# EAGLE design FabISP_Rev3 (EAGLE 6.4)
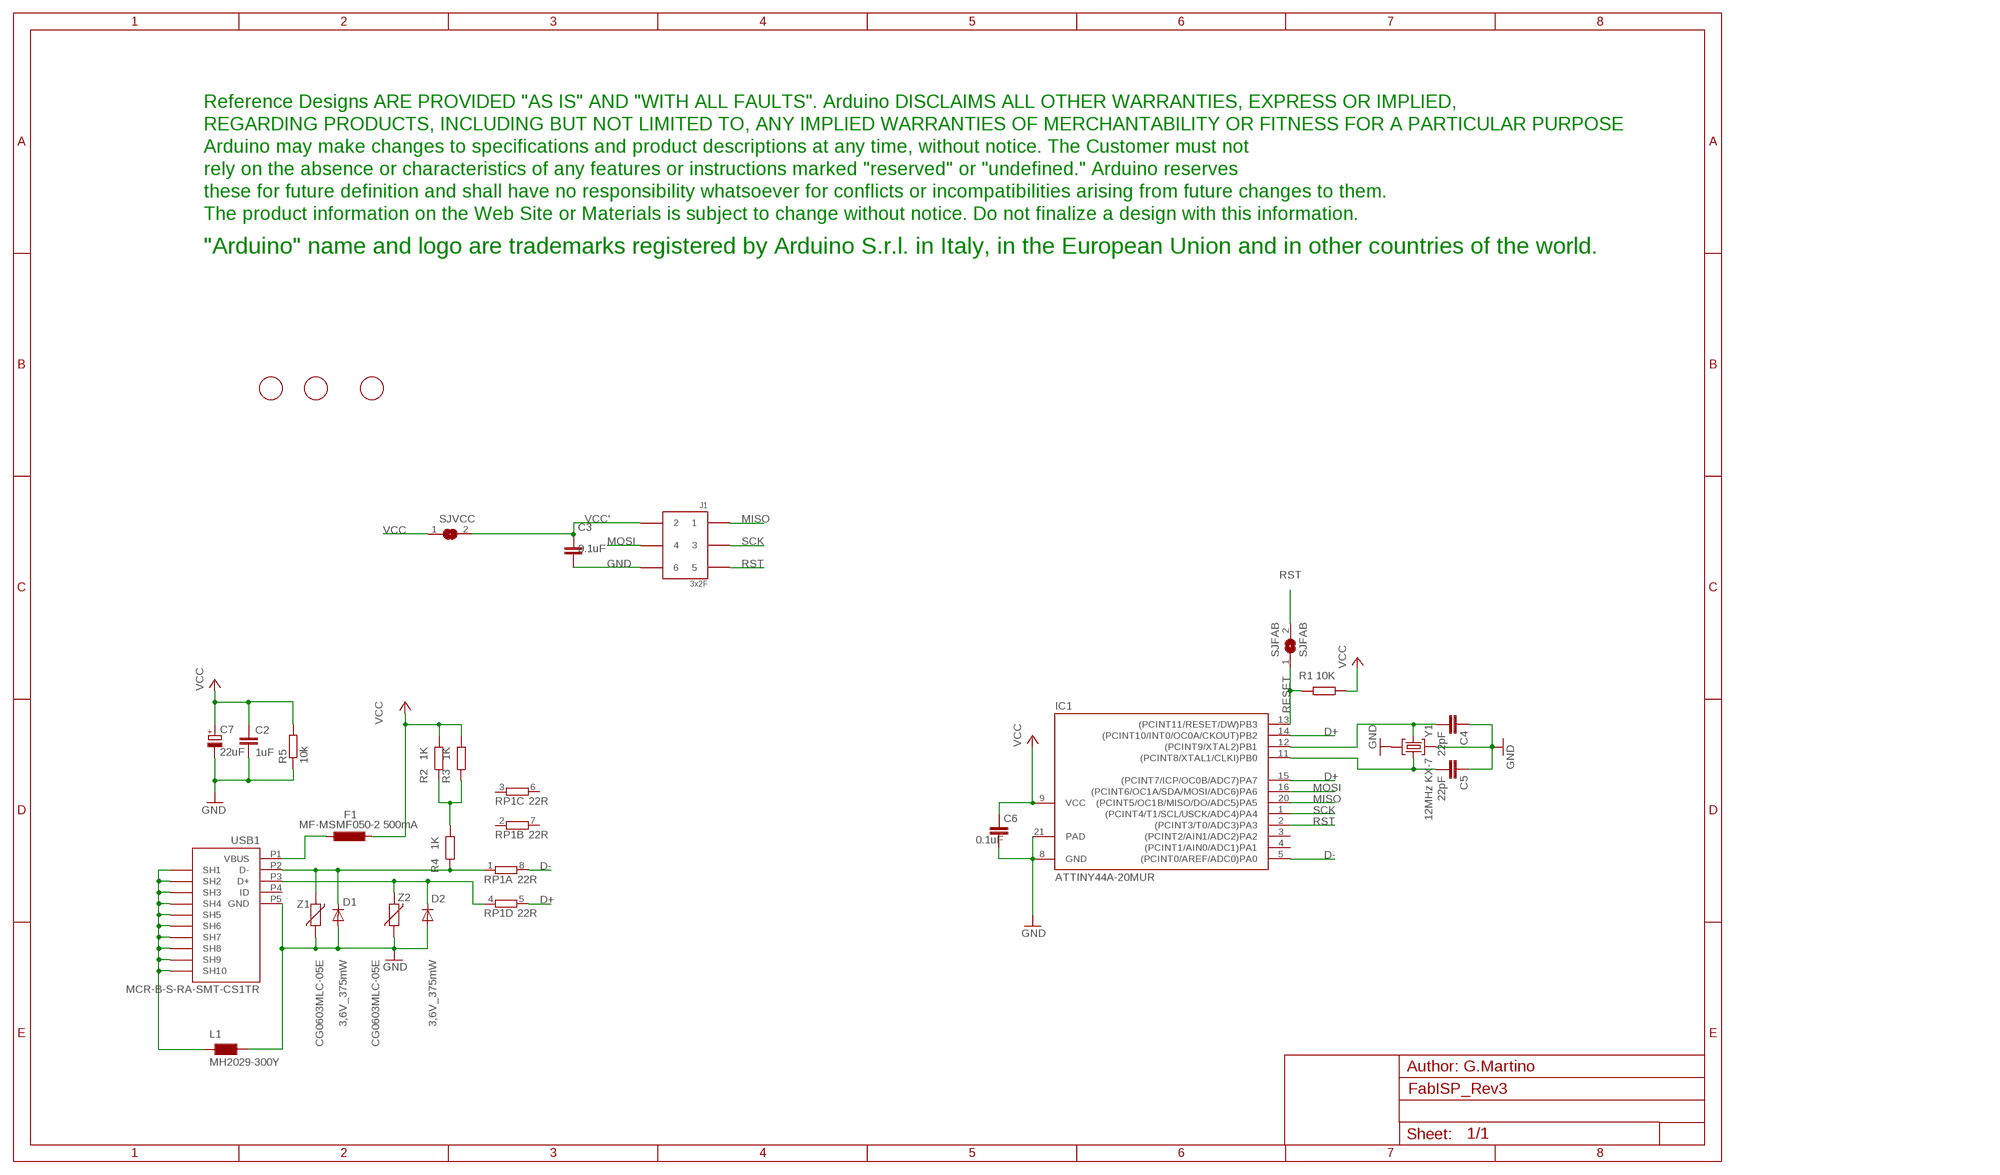
[diagram p0: schematic, sheet 1]

## Parts
C2  1uF  C-EUC0402  [C0402]
C3  0.1uF  C-EUC0402  [C0402]
C4  22pF  C-EUC0402  [C0402]
C5  22pF  C-EUC0402  [C0402]
C6  0.1uF  C-EUC0402  [C0402]
C7  22uF  0167_  [SMC_B]
D1  3,6V_375mW  0730_BZT52H-B3V6  [SOD123]
D2  3,6V_375mW  0730_BZT52H-B3V6  [SOD123]
F1  MF-MSMF050-2 500mA  L-EUL1812  [L1812]
IC1  ATTINY44A-20MUR  ATTINY24_44_84_ATTINY24/44/84-MU  [ATTINY24_44_84_QFN/MLF20]
J1  3x2F  HEAD3X2  [HEAD3X2]
L1  MH2029-300Y  0001_BLM21PG300SN1D_/_MH2029-300Y  [0805]
R1  10K  R-EU_R0402  [R0402]
R2  1K  R-EU_R0402  [R0402]
R3  1K  R-EU_R0402  [R0402]
R4  1K  R-EU_R0402  [R0402]
R5  10k  0028_CR0603JW103L  [R0603-ROUND]
RP1  22R  4R-NCAY16  [CAY16]
SJFAB  SJFAB  [SJFAB]
SJVCC  SJFAB  [SJFAB]
U$1  FIDUCIALMOUNT  [FIDUCIA-MOUNT]
U$2  FIDUCIALMOUNT  [FIDUCIA-MOUNT]
U$3  FIDUCIALMOUNT  [FIDUCIA-MOUNT]
U$5  DISCLAIMER  [DISCLAIMER]
USB1  MCR-B-S-RA-SMT-CS1TR  0158_MCR-B-S-RA-SMT-CS1TR  [CON2_USB_MICRO_B_AT]
Y1  12MHz KX-7  CRYSTAL-3.2-2.5  [CRYSTAL-3.2-2.5]
Z1  CG0603MLC-05E  VARISTORCN0603  [CT/CN0603]
Z2  CG0603MLC-05E  VARISTORCN0603  [CT/CN0603]

## Nets
D+: IC1.14((PCINT10/INT0/OC0A/CKOUT)PB2) IC1.15((PCINT7/ICP/OC0B/ADC7)PA7) RP1.5
D-: IC1.5((PCINT0/AREF/ADC0)PA0) RP1.8
GND: C2.2 C3.2 C4.1 C5.1 C6.2 C7.- D1.A D2.A IC1.8(GND) IC1.21(PAD) J1.6 L1.2 R5.1 USB1.P5(GND) Y1.2(GND) Y1.4(GND) Z1.1 Z2.1
MISO: IC1.20((PCINT5/OC1B/MISO/DO/ADC5)PA5) J1.1
MOSI: IC1.16((PCINT6/OC1A/SDA/MOSI/ADC6)PA6) J1.4
N$1: D1.C R4.1 RP1.1 USB1.P2(D-) Z1.2
N$2: D2.C RP1.4 USB1.P3(D+) Z2.2
N$3: R2.1 R3.1 R4.2
N$5: L1.1 USB1.P$1(SH7) USB1.P$2(SH8) USB1.P$3(SH9) USB1.P$4(SH10) USB1.P$5(SH7) USB1.P$6(SH8) USB1.P$7(SH9) USB1.P$8(SH10) USB1.S1(SH1) USB1.S2(SH2) USB1.S3(SH3) USB1.S4(SH4) USB1.S5(SH5) USB1.S6(SH6)
N$8: F1.2 USB1.P1(VBUS)
RESET: IC1.13((PCINT11/RESET/DW)PB3) R1.1 SJFAB.1
RST: IC1.2((PCINT3/T0/ADC3)PA3) J1.5 SJFAB.2
SCK: IC1.1((PCINT4/T1/SCL/USCK/ADC4)PA4) J1.3
VCC: C2.1 C6.1 C7.+ F1.1 IC1.9(VCC) R1.2 R2.2 R3.2 R5.2 SJVCC.1
VCC': C3.1 J1.2 SJVCC.2
XTAL1: C4.2 IC1.12((PCINT9/XTAL2)PB1) Y1.3(C2)
XTAL2: C5.2 IC1.11((PCINT8/XTAL1/CLKI)PB0) Y1.1(C1)
Unconnected: IC1.3((PCINT2/AIN1/ADC2)PA2) IC1.4((PCINT1/AIN0/ADC1)PA1) RP1.2 RP1.3 RP1.6 RP1.7 USB1.P4(ID)

## Notes on the sheet
- Author: G.Martino

## Library data of the parts
C2-C6 = Smartprj:C-EU: CAPACITOR, European symbol
C7 = Condensatori:0167_: 22uF 25V; MONTHLY_USAGE: _____; PRICE: _____; SUPPLIER: _____; TYPE: Condensatori
D1 D2 = Diodi:0730_BZT52H-B3V6: Single Zener diode 3,6V 375mW SOD 123; CASE: SOD123; MONTHLY_USAGE: _____; PART_NUMBER: BZT52H-B3V6; PRICE: _____; SUPPLIER: _____; TYPE: Diodi
F1 = rcl:L-EU: INDUCTOR, European symbol
IC1 = Smartprj:ATTINY24_44_84_ATTINY24/44/84
J1 = MyCON2:HEAD3X2
L1 = Protezione:0001_BLM21PG300SN1D_/_MH2029-300Y: BLM21; MONTHLY_USAGE: _____; PART_NUMBER: BLM21PG300SN1D_/_MH2029-300Y; PRICE: _____; SUPPLIER: _____; TYPE: Protezione
R1-R4 = Smartprj:R-EU_: RESISTOR, European symbol
R5 = Resistenze:0028_CR0603JW103L: 10K 0603; CASE: 0603; MONTHLY_USAGE: _____; PART_NUMBER: CR0603JW103L; PRICE: _____; SUPPLIER: _____; TYPE: Resistenze
RP1 = resistor-dil:4R-N: Array Chip Resistor Source: RS Component / Phycomp
SJFAB SJVCC = mellis:SJFAB
U$1-U$3 = Smartprj:FIDUCIALMOUNT
U$5 = Misc:DISCLAIMER
USB1 = Connettori:0158_MCR-B-S-RA-SMT-CS1TR: Usb Micro F/90 Smd Tipo B; MONTHLY_USAGE: _____; PART_NUMBER: MCR-B-S-RA-SMT-CS1TR; PRICE: _____; SUPPLIER: _____; TYPE: Connettori
Y1 = Smartprj:CRYSTAL-3.2-2.5
Z1 Z2 = varistor:VARISTOR: VARISTOR

## Board
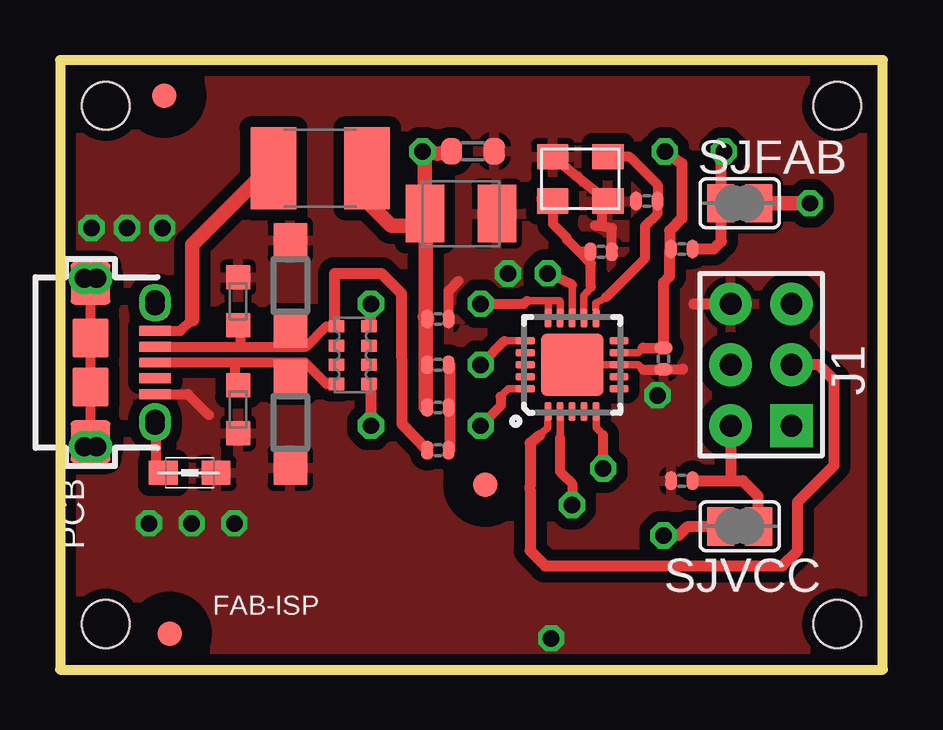
[diagram p1: board, top side]
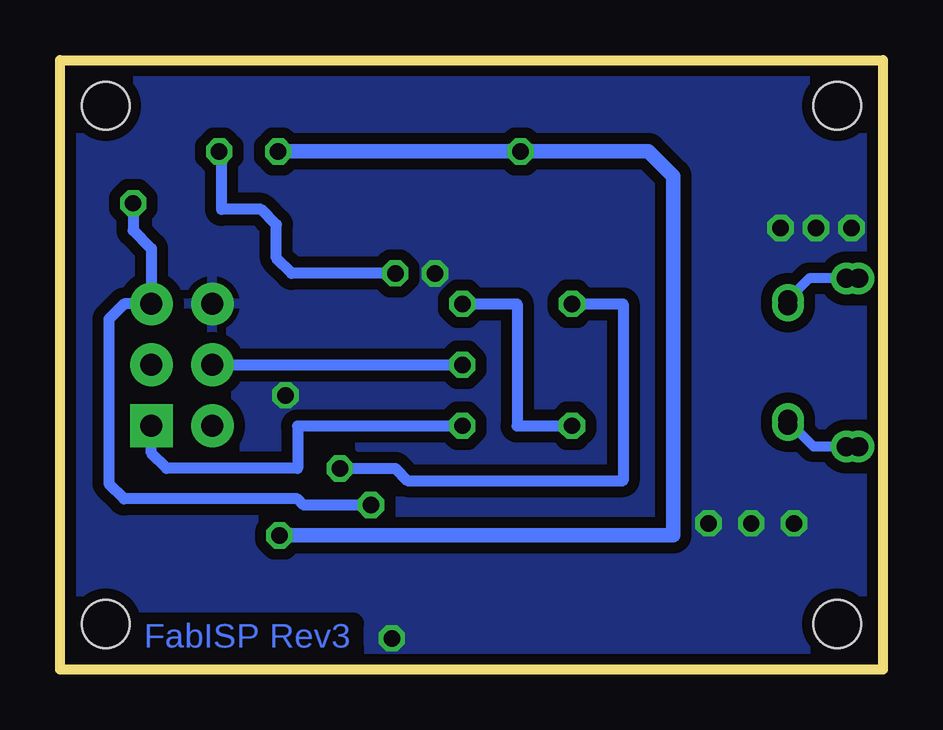
[diagram p2: board, bottom side, seen from below]

Size 34.29 x 25.4 mm. Coordinates in mm from the lower left corner, seen from the top.
Outline: 0,0 34.29,0 34.29,25.4 0,25.4 0,0
Copper layers (1*16): Top 0.035mm / dielectric 1.5mm / Bottom 0.035mm
Design rules "default *": minimum track width 11mil, minimum drill 27mil, track to track 7mil, track to pad 7mil, pad to pad 7mil, via to via 16mil, smd to smd 0mil, copper to edge 17mil, drill to drill 8mil, minimum pad ring 10mil, minimum via ring 8mil, stop-mask expansion 2mil, vias tented up to drill 27mil, thermal gap 10mil
Holes 2 mm at 32.38,23.5 1.91,23.5 1.91,1.91 32.38,1.91

### Footprints (pad centres in the part's own frame; a part is rotated, then mirrored left to right if it is on the bottom)
C0402 = smd 0.508 x 0.762: 1 -0.445,0; 2 0.445,0
SMC_B = smd 1.6 x 2.4: + -1.5,0; - 1.5,0
SOD123 = smd 1.4 x 1.4: A 1.9,0; C -1.9,0
L1812 = smd 1.9 x 3.4: 1 -1.95,0; 2 1.95,0
ATTINY24_44_84_QFN/MLF20 = smd 0.8 x 0.3: 1 -1.95,1; 2 -1.95,0.5; 3 -1.95,0; 4 -1.95,-0.5; 5 -1.95,-1; 11 1.95,-1; 12 1.95,-0.5; 13 1.95,0; 14 1.95,0.5; 15 1.95,1 | smd 0.3 x 0.8: 6 -1,-1.95; 7 -0.5,-1.95; 8 0,-1.95; 9 0.5,-1.95; 10 1,-1.95; 16 1,1.95; 17 0.5,1.95; 18 0,1.95; 19 -0.5,1.95; 20 -1,1.95 | smd 2.6 x 2.6: 21 0,0
HEAD3X2 = drill 0.914 pad 1.778 square: 1 0,0 | drill 0.914 pad 1.778: 2 0,2.54; 3 2.54,0; 4 2.54,2.54; 5 5.08,0; 6 5.08,2.54
0805 = smd 1.2 x 1: 1 -1.1,0; 2 1.1,0
R0402 = smd 0.508 x 0.762: 1 -0.445,0; 2 0.445,0
R0603-ROUND = smd 0.898 x 1.1: 1 -0.889,0; 2 0.889,0
CAY16 = smd 0.5 x 0.65: 1 -1.2,-0.675; 2 -0.4,-0.675; 3 0.4,-0.675; 4 1.2,-0.675; 5 1.2,0.675; 6 0.4,0.675; 7 -0.4,0.675; 8 -1.2,0.675
SJFAB = smd 1.118 x 1.6: 1 -0.787,0; 2 0.787,0
FIDUCIA-MOUNT = smd 1.016 x 1.016: P$1 0,0
CON2_USB_MICRO_B_AT = smd 0.406 x 1.346: P1 -1.321,2.692; P2 -0.66,2.692; P3 0,2.692; P4 0.66,2.692; P5 1.321,2.692 | drill 0.8 pad 1.24: P$1 -2.616,2.692; P$2 -2.362,2.692; P$7 2.362,2.692; P$8 2.616,2.692 | drill 0.8 pad 1.25: P$3 -3.505,-0.254; P$4 -3.505,0.254; P$5 3.505,0.254; P$6 3.505,-0.254 | smd 1.778 x 1.651: S1 -3.302,0; S2 3.302,0 | smd 1.524 x 1.27: S3 -2.489,2.692; S4 2.489,2.692 | smd 1.626 x 1.524: S5 -1.016,0; S6 1.016,0
CRYSTAL-3.2-2.5 = smd 1.3 x 1.05: 1 -1.15,-0.925; 2 1.15,-0.925; 3 1.15,0.925; 4 -1.15,0.925
CT/CN0603 = smd 1 x 1: 1 -1,0; 2 1,0

### Placement (x,y rotation side)
C2  15.75,14.61 0 top
C3  25.91,7.87 180 top
C4  22.55,17.41 180 top
C5  24.45,19.52 0 top
C6  25.15,12.95 270 top
C7  16.7,19 0 top
D1  9.6,16 90 top
D2  9.6,10.3 270 top
F1  10.85,20.89 180 top
IC1  21.34,12.7 90 top
J1  30.48,10.16 90 top
L1  5.4,8.2 0 top
R1  25.91,17.53 180 top
R2  15.75,12.7 180 top
R3  15.75,10.92 180 top
R4  15.75,9.14 0 top
R5  17.2,21.6 180 top
RP1  12.19,13.1 270 top
SJFAB  28.32,19.43 0 top
SJVCC  28.32,5.97 0 top
U$1  4.57,1.5 0 top
U$2  17.72,7.7 0 top
U$3  4.34,23.9 0 top
U$5  -5.2,-41 0 top  (outside the outline)
USB1  1.27,12.8 270 top
Y1  21.68,20.45 180 top
Z1  7.42,15.35 270 top
Z2  7.42,10.85 90 top

### Tracks (layer width: path | path; a pad name or v marks a point on that pad's centre or on a via)
D+  (via drill 0.69)
  Top 0.305: IC1.14 20.84,15.28 20.83,15.37 20.34,15.37 | 20.34,15.37 19.46,15.37 | IC1.15 20.34,15.28 20.34,15.37
  Top 0.406: v17.53,15.24 19.33,15.24 19.46,15.37 | RP1.5 12.95,11.5
  Top 0.457: 12.95,11.5 v12.95,10.16
  Bottom 0.457: v17.53,15.24 15.24,15.24 15.24,10.16 v12.95,10.16
D-  (via drill 0.69)
  Top 0.305: IC1.5 22.34,10.07 22.63,9.78
  Top 0.406: RP1.8 12.95,14.4 | v22.63,8.38 22.63,9.78
  Top 0.457: 12.95,14.4 v12.95,15.24
  Bottom 0.457: v12.95,15.24 10.82,15.24 10.82,7.87 19.81,7.87 20.32,8.38 v22.63,8.38
GND  (via drill 0.69)
  Top 0.305: IC1.21 IC1.8 24.1,12.7 24.3,12.5
  Top 0.406: Y1.2 arc3 Y1.4 22.6,19.49 22.6,18.5 22.3,18.5 23,18.4 22.99,18.39 C4.1 | 25.95,12.55 25.95,12.51 C6.2 25.14,12.5 24.3,12.5 | C2.2 16.19,15.79 16.6,16.2 | USB1.P5 5.33,11.47 6.2,10.6
  Top 0.457: 26.42,15.24 J1.6
  other vias: 24.89,11.43 4.27,18.4 7.27,6.1 2.79,18.4 5.49,6.1 1.31,18.4 3.71,6.1 20.47,1.3 18.67,16.5
  pour Top (isolate 0.457): 0,25.27 0,0 34.29,0 34.29,25.4 0,25.4
  pour Bottom (isolate 0.457): 0,25.4 34.29,25.4 34.29,0 0,0
MISO  (via drill 0.69)
  Top 0.305: IC1.20 18.68,11.7 18.36,11.38
  Top 0.406: 18.36,11.38 18.36,10.99 v17.53,10.16
  Bottom 0.457: J1.1 30.48,9.02 29.84,8.38 24.38,8.38 24.38,10.16 v17.53,10.16
MOSI  (via drill 0.69)
  Top 0.305: IC1.16 18.52,13.7
  Top 0.406: 18.52,13.7 v17.53,12.7
  Bottom 0.457: J1.4 v17.53,12.7
N$1
  Top 0.406: 11.43,14.37 RP1.1 | 11.59,14.29 RP1.1 | USB1.P2 7.5,13.46 | 7.5,13.46 9.6,13.46 | 9.6,13.46 10.26,13.46 11.1,14.3 RP1.1 | Z1.2 7.5,14.27 7.5,13.46 | D1.C 9.6,13.46
  Top 0.457: 11.43,14.37 11.43,16.51 13.39,16.51 14.22,15.68 14.25,10.24 15.29,9.17 R4.1
N$2
  Top 0.406: USB1.P3 7.3,12.8 | 7.3,12.8 9.7,12.8 | 9.7,12.8 10.2,12.8 11.1,11.9 RP1.4 | Z2.2 7.3,11.97 7.3,12.8 | D2.C 9.7,12.3 9.7,12.8
N$3
  Top 0.406: 16.26,10.79 R3.1 | 16.26,9.14 R4.2 | 16.26,12.7 R2.1
  Top 0.457: 16.26,9.14 16.26,10.79 | 16.26,12.7 16.26,10.92 R3.1
N$5
  Top 0.406: L1.1 4,8.5 4,10.14 USB1.P$8 USB1.S4 USB1.P$7 | USB1.S1 USB1.S5 USB1.S6 USB1.S2 | USB1.P$6 1.07,9.29 USB1.S2 | USB1.S2 1.32,9.49 USB1.P$5 1.69,9.29 1.9,9.5 1.8,9.5 1.7,9.4 | USB1.P$4 1.47,16.3 USB1.S1 | USB1.P$3 1.07,16.3 USB1.S1
  Top 0.61: USB1.P$1 USB1.S3 USB1.P$2
  Bottom 0.406: USB1.P$4 3.07,16.3 USB1.P$1 | USB1.P$7 3.96,10.36 2.9,9.3 1.53,9.3 USB1.P$5
N$8
  Top 0.406: USB1.P1 5.02,14.12 5.5,14.6
  Top 0.61: 5.5,14.6 5.5,17.7 8.8,21 8.8,21.79 F1.2
RESET  (via drill 0.69)
  Top 0.305: IC1.13 21.34,16.03
  Top 0.406: 27.43,19.3 SJFAB.1 27.56,19.43 27.69,19.56 27.69,19.3 27.56,19.3 | 21.34,16.03 v20.32,16.51
  Top 0.457: R1.1 27.24,17.53 27.56,17.84 27.56,19.3 27.56,21.49 v27.66,21.59
  Bottom 0.457: v20.32,16.51 24.64,16.51 25.27,17.14 25.27,18.54 25.91,19.18 27.56,19.18 27.56,21.49 v27.66,21.59
RST  (via drill 0.69)
  Top 0.305: IC1.2 20.84,9.71 20.83,9.65
  Top 0.406: 20.85,8.23 20.92,8.16 | 20.92,8.16 21.34,7.75 v21.34,6.86 | 20.83,9.65 20.83,8.26 20.85,8.23 | 20.85,8.23 20.9,8.18 20.91,8.18 20.92,8.16
  Top 0.61: v31.24,19.43 SJFAB.2
  Bottom 0.457: v21.34,6.86 24.13,6.86 24.38,7.11 31.62,7.11 32.26,7.75 32.26,14.61 31.62,15.24 J1.5 30.48,17.54 31.24,18.3 v31.24,19.43
SCK
  Top 0.305: 19.98,9.76 20.33,10.07 IC1.1
  Top 0.406: 19.58,7.62 19.58,7.52
  Top 0.457: J1.3 31.62,12.7 32.26,12.06 32.26,8.51 31.62,7.87 31.37,7.62 30.73,6.99 30.73,4.95 30.1,4.32 27.18,4.32 20.22,4.32 19.58,4.95 19.58,7.52 | 19.98,9.76 19.58,9.45 19.58,7.62
VCC  (via drill 0.69)
  Top 0.305: IC1.9 24.1,13.2 24.3,13.4 | C6.1 25.34,13.4 25.15,13.46
  Top 0.406: 15.24,12.95 R2.2 15.24,12.57 | 15.24,10.92 R3.2 | 15.24,14.73 C2.1 | 25.4,17.46 R1.2
  Top 0.457: 24.3,13.4 C6.1 25.15,13.46 25.15,16.13 25.4,16.38 25.4,17.46 25.4,18.29 25.91,18.8 25.91,21.08 v25.2,21.59 | v25.15,5.59 25.78,5.59 26.16,5.97 SJVCC.1
  Top 0.61: 15.24,10.92 15.24,12.57 15.24,12.95 15.24,14.73 15.24,18.96 C7.+ | 15.2,14.71 C2.1 | R5.2 15.71,21.5 v15.1,21.59 15.2,21.39 C7.+ | F1.1 12.8,19.5 13.8,18.5 15.3,18.5 15.4,18.4 15.4,18.8 C7.+
  Bottom 0.61: v25.15,5.59 8.74,5.59 8.74,20.55 9.78,21.59 v15.1,21.59 | v25.2,21.59 15.89,21.59 | 15.89,21.59 15.81,21.59 | 15.81,21.59 15.8,21.6 | 15.8,21.6 15.8,21.59 v15.1,21.59 | v15.1,21.59 15.81,21.59 | 15.89,21.59 15.8,21.6
VCC'
  Top 0.406: 29.08,5.97 SJVCC.2
  Top 0.457: J1.2 27.94,7.87 | 27.94,7.87 28.45,7.87 29.08,7.24 29.08,5.97 | C3.1 27.94,7.87
XTAL1
  Top 0.305: IC1.12 21.83,14.95 21.83,15.58 22.12,15.9
  Top 0.356: 22.12,15.9 22.12,15.95
  Top 0.406: 22.12,15.95 22.12,16.92 21.63,17.41 | 20.07,19.56 20.07,19.65 Y1.3 20.53,18.58 21.1,18.01 21.13,17.91 21.63,17.41 | C4.2 21.63,17.41
XTAL2
  Top 0.305: IC1.11 22.33,15.27 22.76,15.52
  Top 0.406: Y1.1 22.63,21.36 23.74,21.36 24.9,20.2 24.9,19.53 C5.2 24.9,19 24.38,18.48 24.38,17.14 22.76,15.52

### Text on the board
Bottom: FabISP Rev3
tPlace: FAB-ISP